# Altium project maxwell_dev_board.PrjPcb
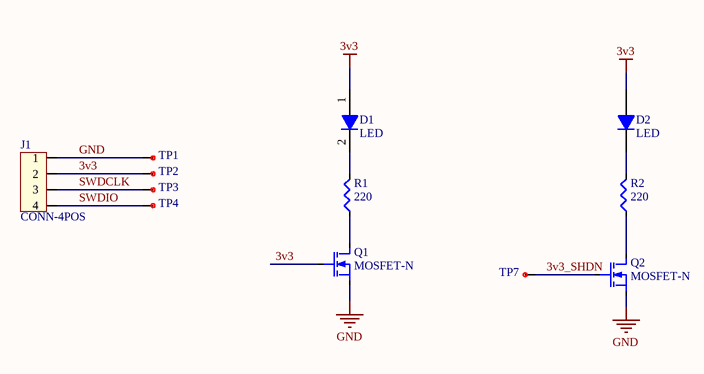
[diagram p0: maxwell_dev_board.SchDoc]
1 sheet, 12 parts. Net scope: global (net labels, ports and power ports of the same name join across sheets).
Board file: maxwell_dev_board.PcbDoc

## Sheet maxwell_dev_board.SchDoc
size A; SheetNumber: 1; SheetTotal: 1

### Parts
D1  LED  [LED_0603]
D2  LED  [LED_0603]
J1  CONN-4POS  [4_PIN_HEADER]
Q1  MOSFET-N  [SOT-23]
Q2  MOSFET-N  [SOT-23]
R1  220  [RES0603]
R2  220  [RES0603]
TP1  TEST_PIN  [TEST_PIN]  (value not drawn)
TP2  TEST_PIN  [TEST_PIN]  (value not drawn)
TP3  TEST_PIN  [TEST_PIN]  (value not drawn)
TP4  TEST_PIN  [TEST_PIN]  (value not drawn)
TP7  TEST_PIN  [TEST_PIN]  (value not drawn)

### Nets
3v3: D1.1(A) D2.1(A) J1.2 Q1.1(G) TP2.1
GND: J1.1 Q1.2(S) Q2.2(S) TP1.1
3v3_SHDN: Q2.1(G) TP7.1
SWDCLK: J1.3 TP3.1
SWDIO: J1.4 TP4.1
NetD1_2: D1.2(K) R1.2
NetD2_2: D2.2(K) R2.2
NetQ1_3: Q1.3(D) R1.1
NetQ2_3: Q2.3(D) R2.1

### Library data of the parts
D1 = LED: Default Diode; PartNumber: 3372-0603GBD0790S01TR-ND; Published: 8-Jun-2000; LatestRevisionDate: 17-Jul-2002; LatestRevisionNote: Re-released for DXP Platform.; PackageVersion: Sep-1996; PackageReference: SMC; Publisher: Altium Limited; PackageDescription: DO-214-AB/SMC; 2 C-Bend Leads; Body 7.9 x 5.9 mm, inc. leads (LxW); Code_JEDEC: DO-214-AB
D2 = LED: Default Diode; Published: 8-Jun-2000; LatestRevisionDate: 17-Jul-2002; LatestRevisionNote: Re-released for DXP Platform.; PackageVersion: Sep-1996; PackageReference: SMC; Publisher: Altium Limited; PackageDescription: DO-214-AB/SMC; 2 C-Bend Leads; Body 7.9 x 5.9 mm, inc. leads (LxW); Code_JEDEC: DO-214-AB
Q1 Q2 = MOSFET-N: N-Channel MOSFET; Published: 8-Jun-2000; LatestRevisionDate: 17-Jul-2002; LatestRevisionNote: Re-released for DXP Platform.; PackageVersion: 1995/1996; PackageReference: E3; Publisher: Altium Limited; PackageDescription: TO, Flat Index; 3 In-Line, Axial Leads; Body Dia. 4.6mm; Lead Dia. 0.5 mm (max)
R1 R2 = RES: Chip Resistor; Value: 1k; Publisher: HabitAware